# EasyEDA Pro project ProProject_keyboard_Tassel43_2024-03-30.epro, schematic C口分离模块
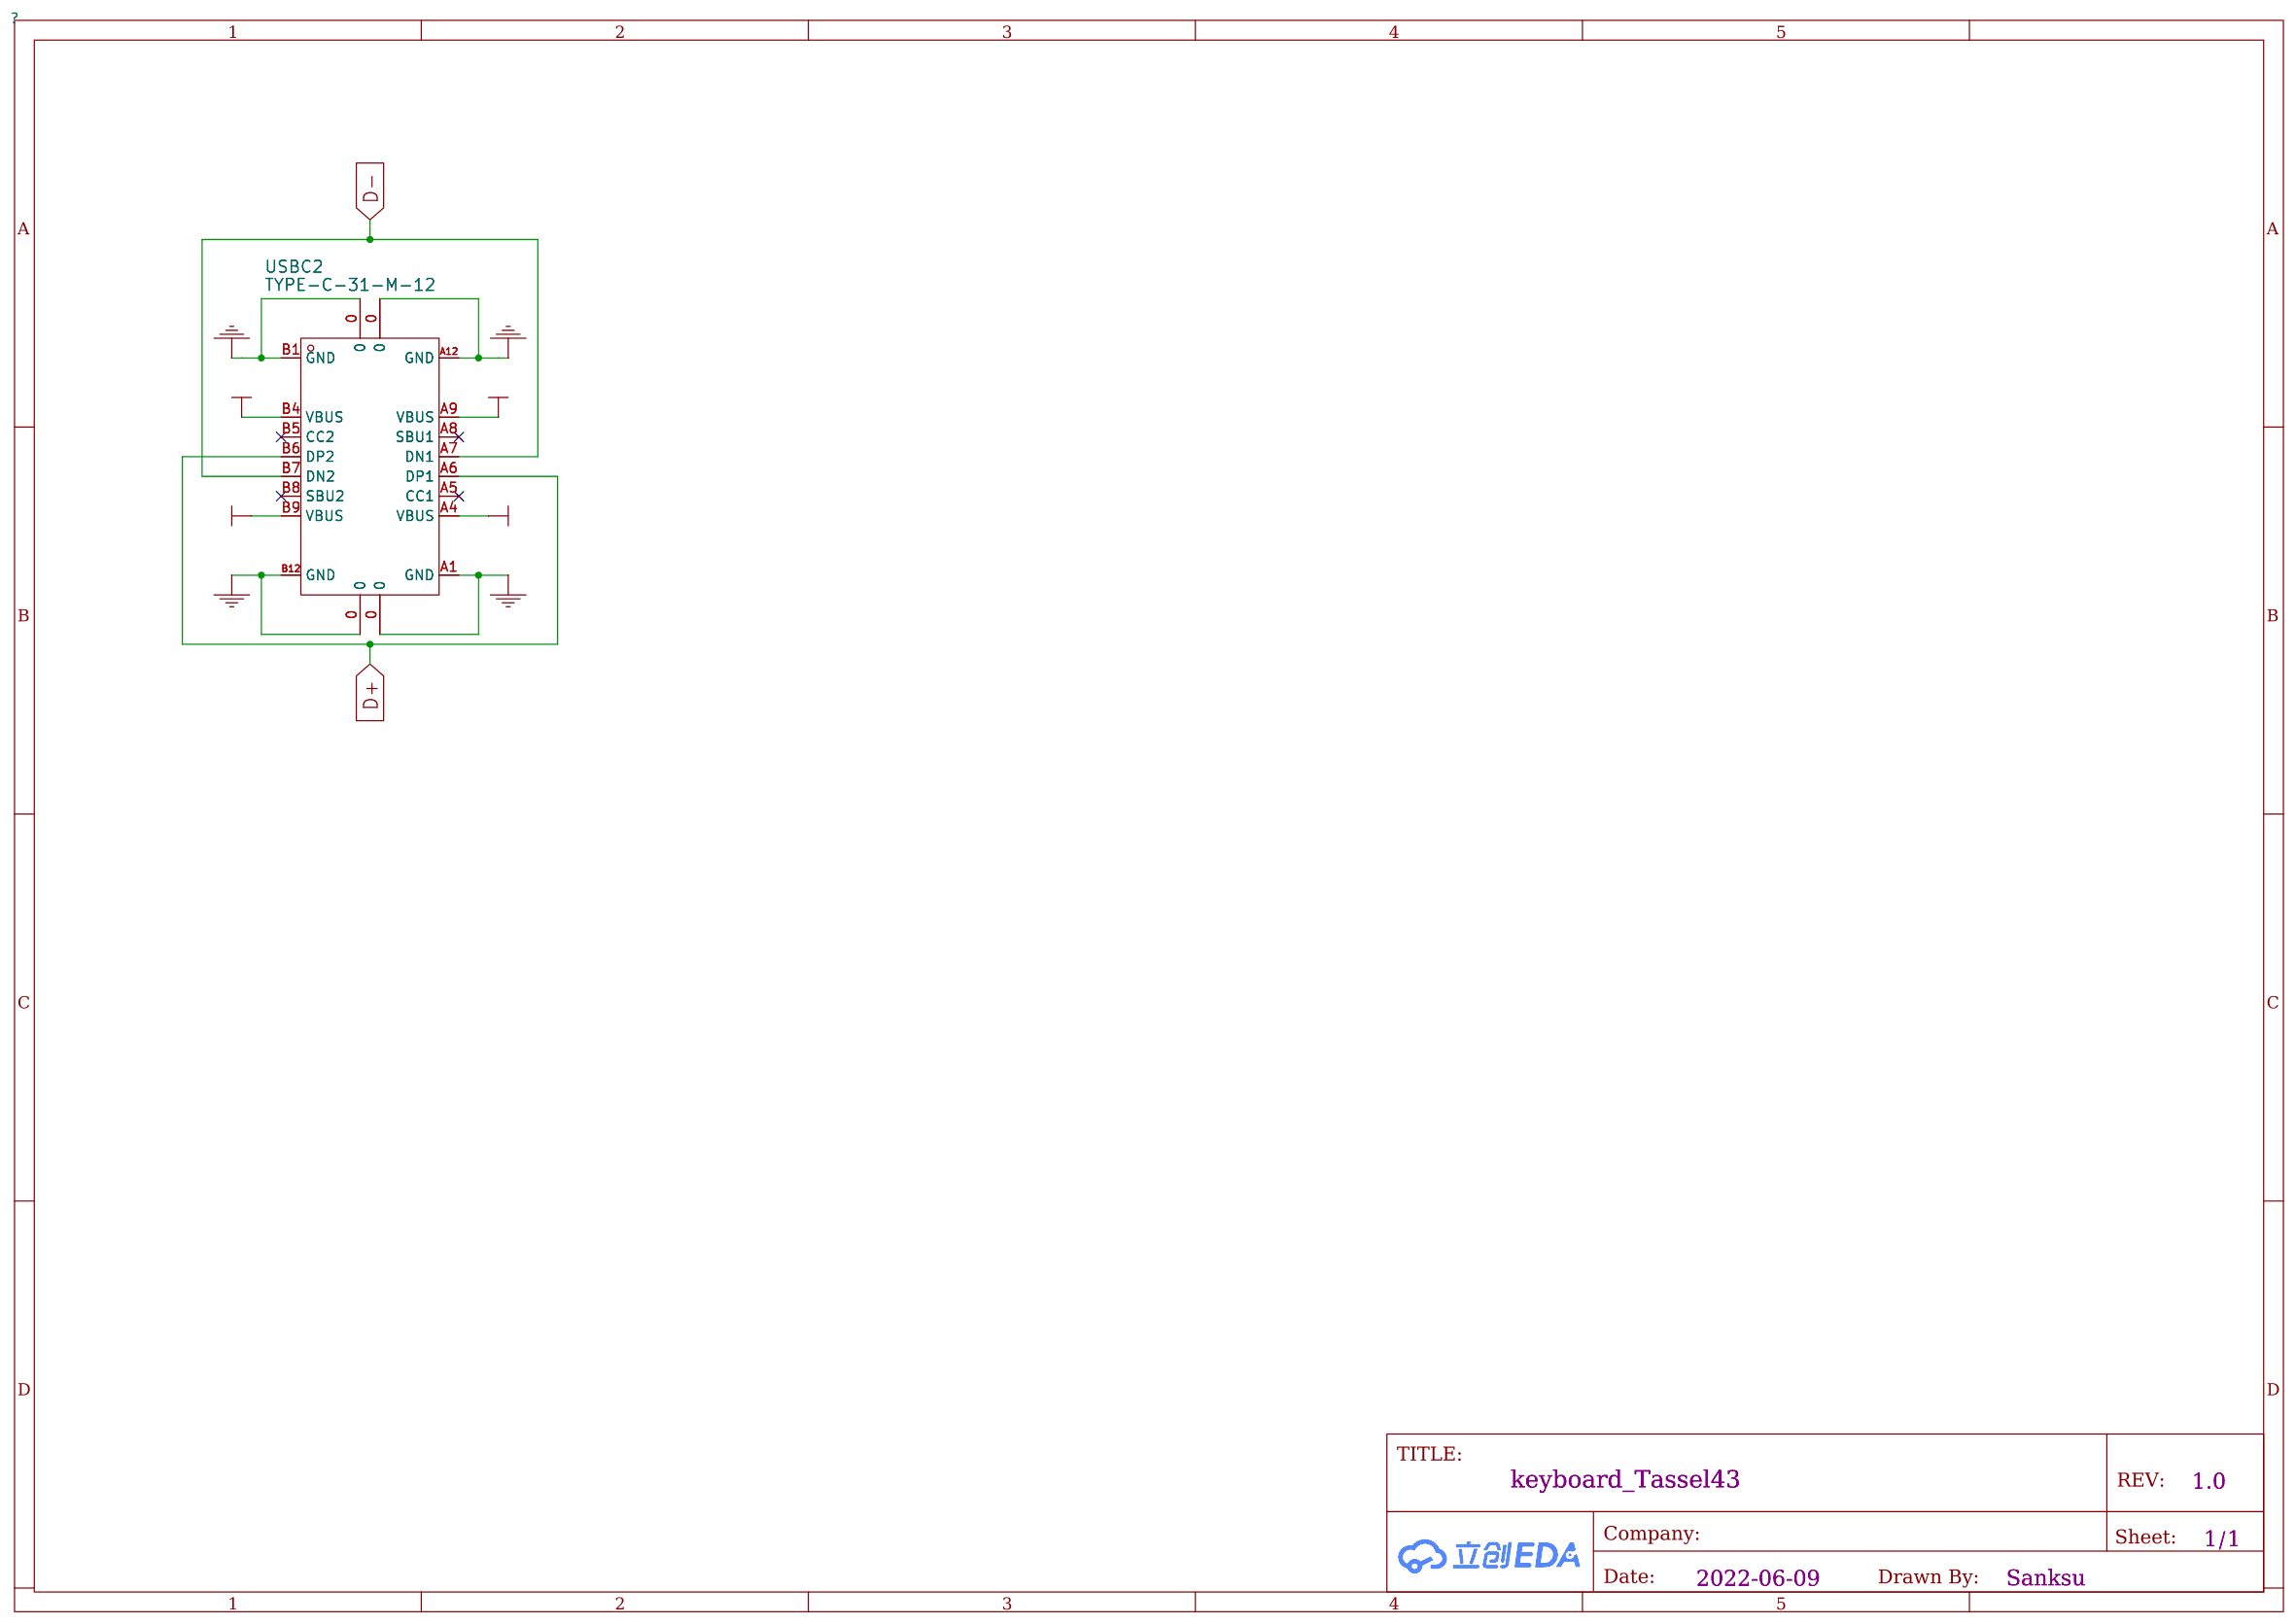
[diagram p1: schematic sheet]

## Parts
USBC2  TYPE-C-31-M-12  [USB-C_SMD-TYPE-C-31-M-12]

## Library data of the parts
USBC2 = TYPE-C-31-M-12: Supplier: LCSC; Supplier Part: C165948; Manufacturer: RectangularConnectors-Contacts; JLCPCB Part Class: ExtendedPart

## Nets
GND: USBC2.0 USBC2.A1(GND) USBC2.A12(GND) USBC2.B1(GND) USBC2.B12(GND)
VBUS: USBC2.A4(VBUS) USBC2.A9(VBUS) USBC2.B4(VBUS) USBC2.B9(VBUS)
D+: USBC2.A6(DP1) USBC2.B6(DP2)
D-: USBC2.A7(DN1) USBC2.B7(DN2)

Not connected (* = marked no-connect by the designer): USBC2 A5(CC1)* A8(SBU1)* B5(CC2)* B8(SBU2)*
